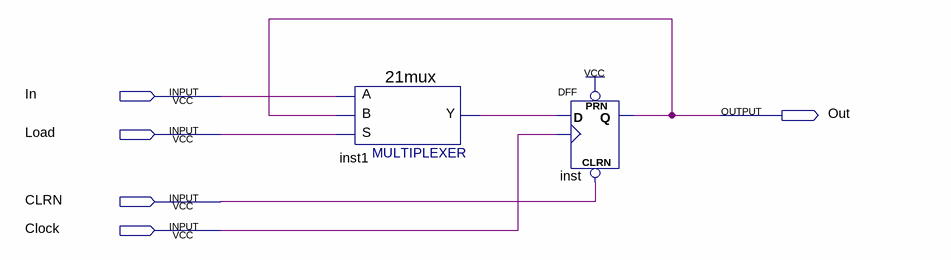
[diagram p0: schematic sheet]
// Quartus schematic register.bdf as structural Verilog: 2 symbols, 5 pins
module register (
  input  In,
  input  Load,
  input  CLRN,
  input  Clock,
  output Out
);

  wire inst1_y;

  \21mux  inst1 (.S(Load), .B(Out), .A(In), .Y(inst1_y));
  DFF inst (.CLRN(CLRN), .CLK(Clock), .D(inst1_y), .PRN(1'b1), .Q(Out));
endmodule
